# Altium schematic sheet 0174_IMVP VCCGT _SOC_.SchDoc
size 848 x 558 mm
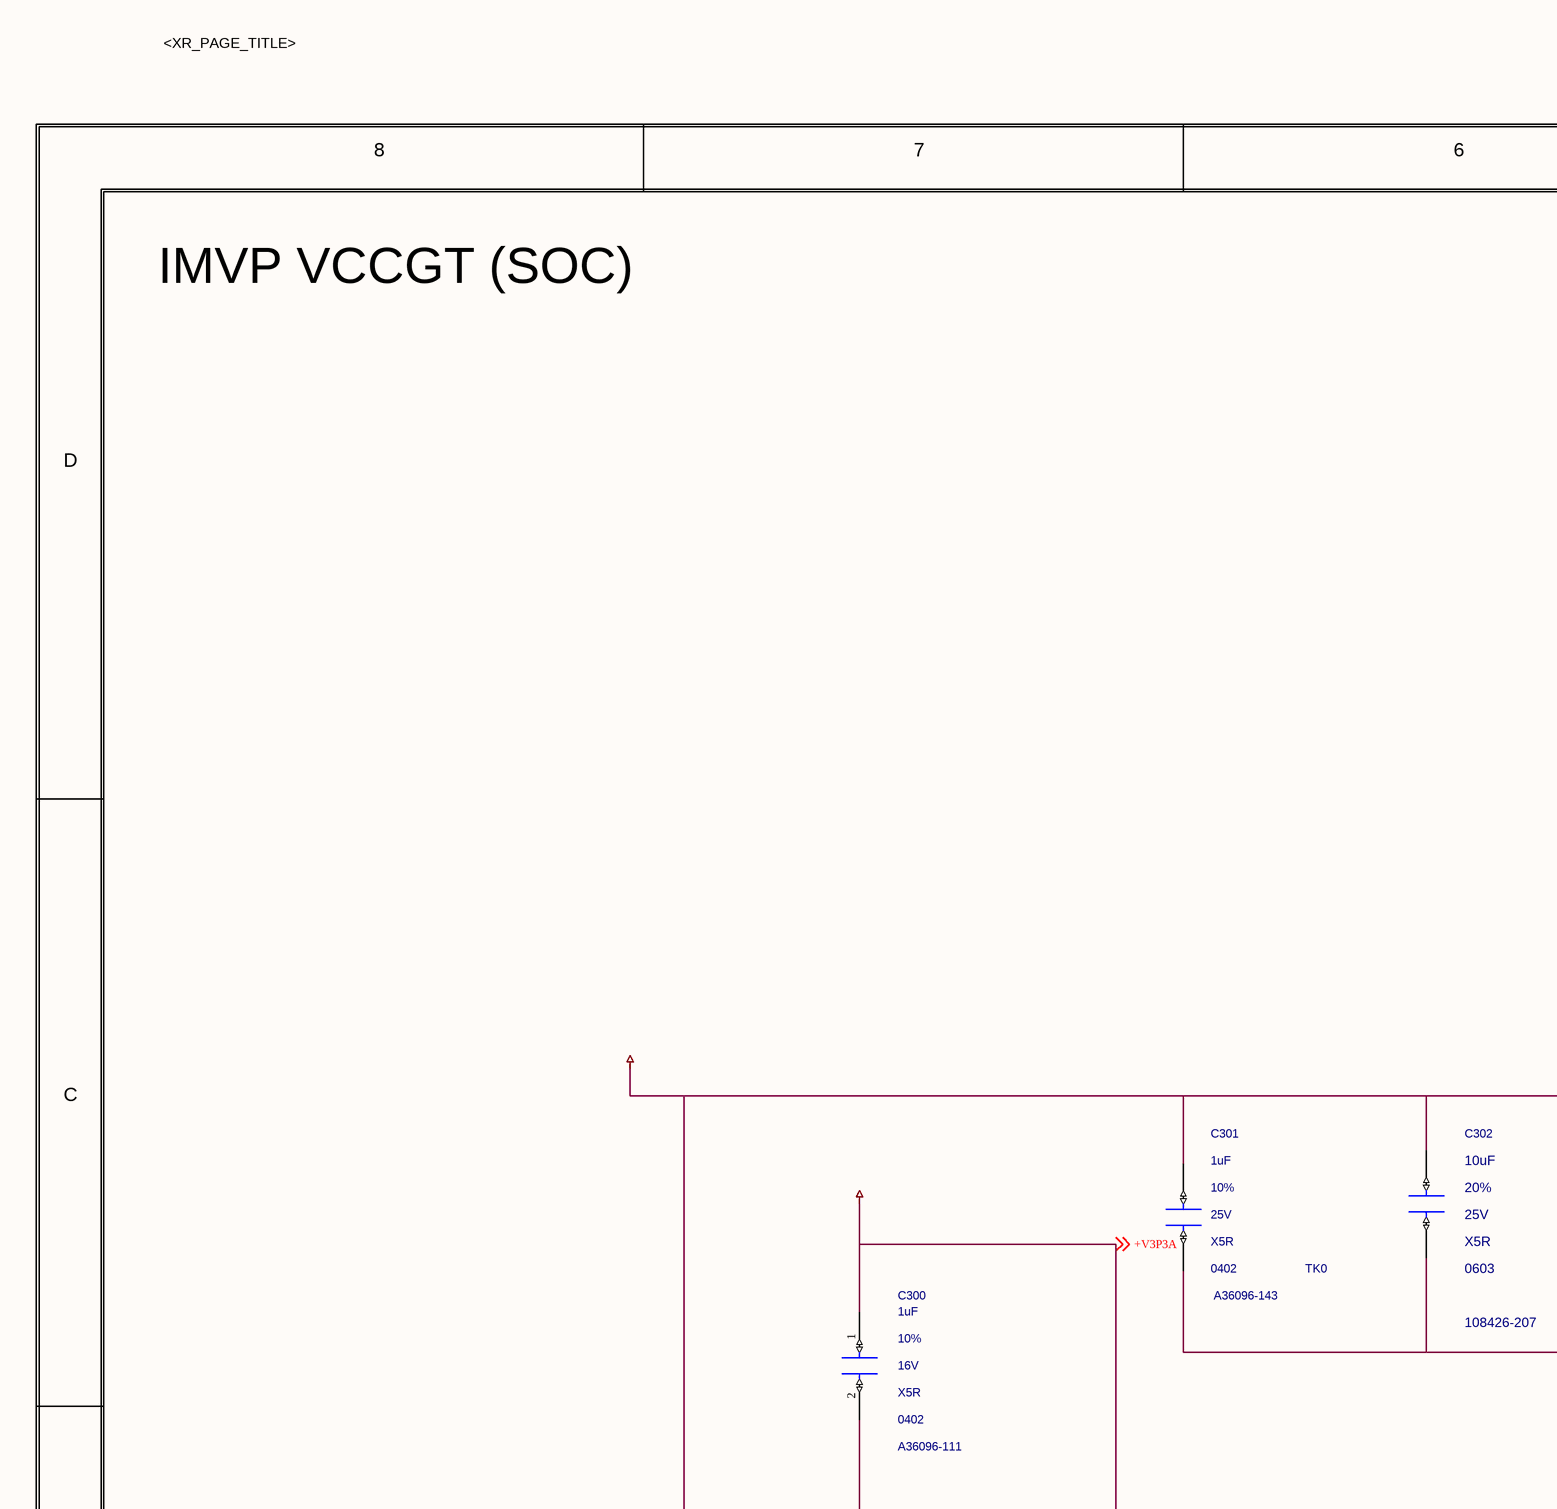
[diagram p0: 0174_IMVP VCCGT _SOC_.SchDoc, top left]
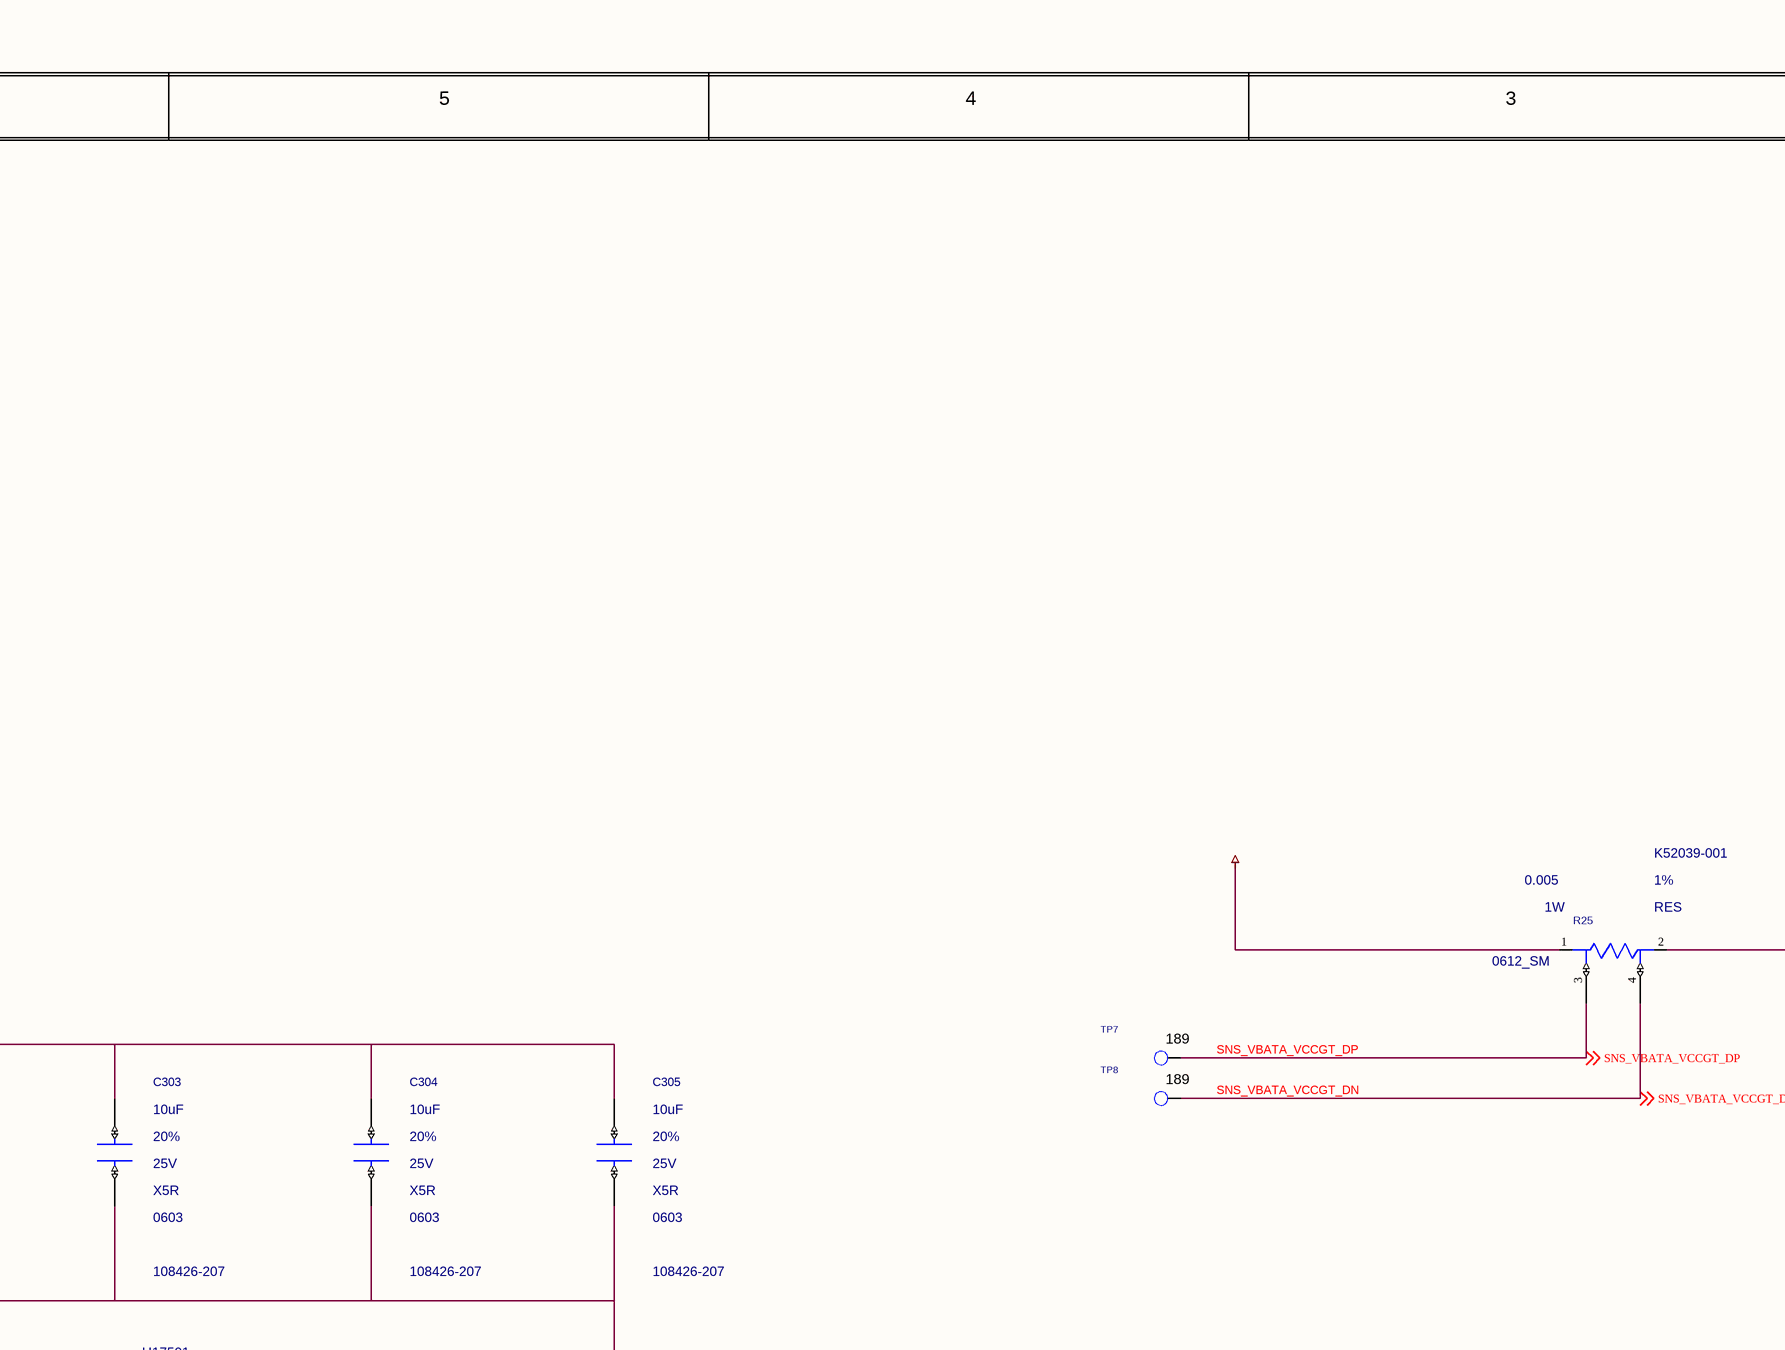
[diagram p1: 0174_IMVP VCCGT _SOC_.SchDoc, top middle]
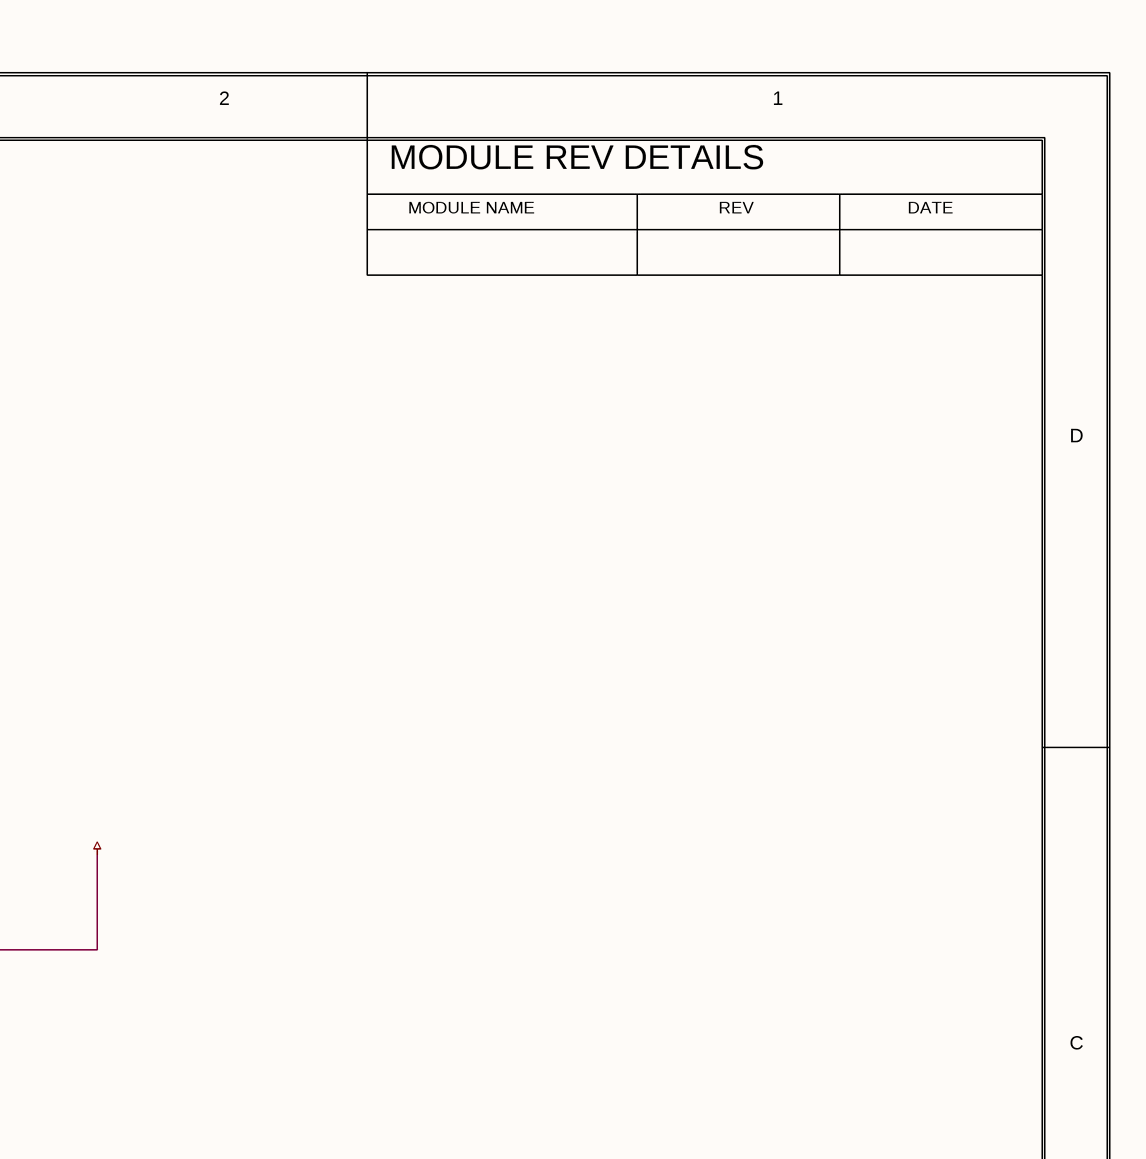
[diagram p2: 0174_IMVP VCCGT _SOC_.SchDoc, top right]
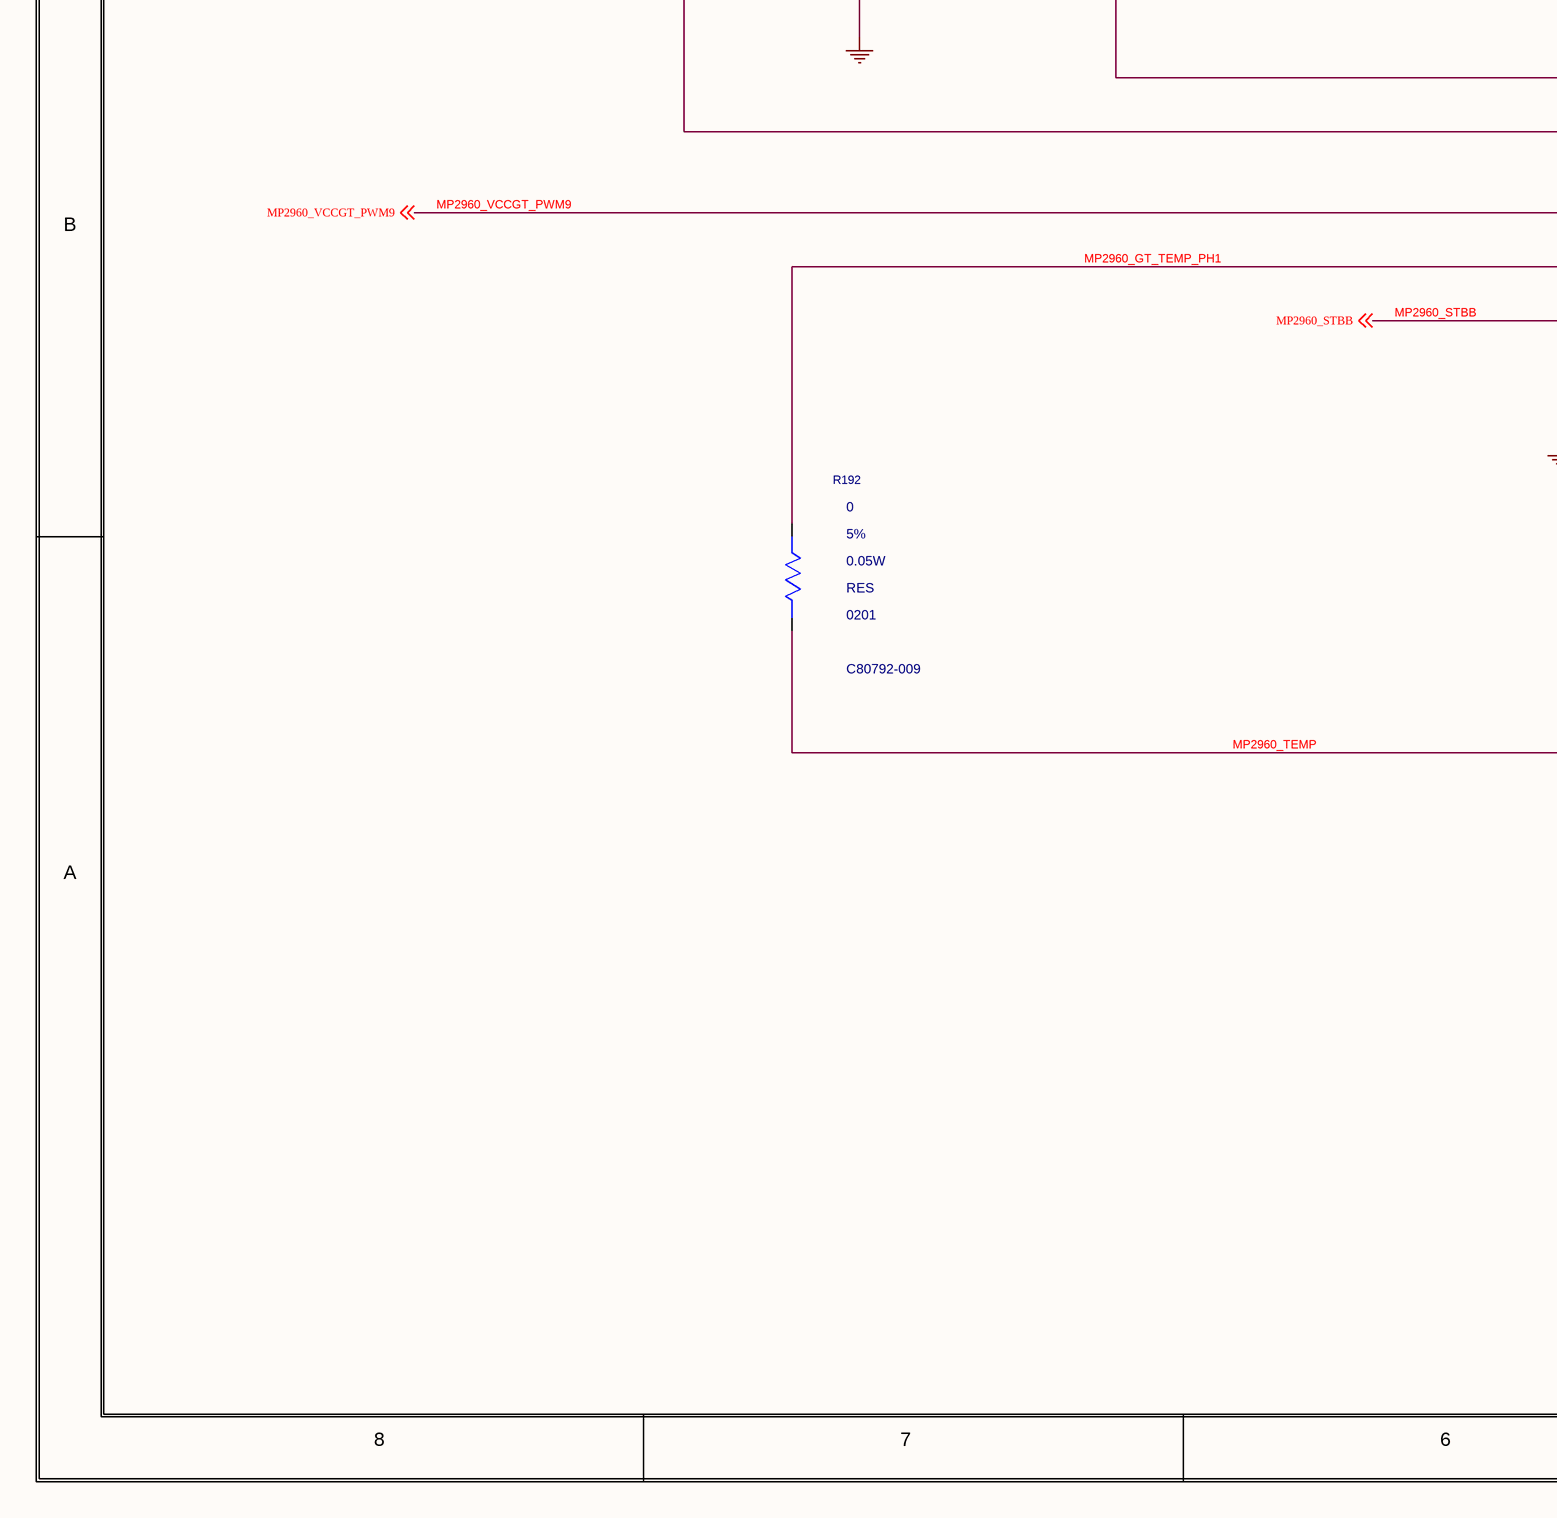
[diagram p3: 0174_IMVP VCCGT _SOC_.SchDoc, bottom left]
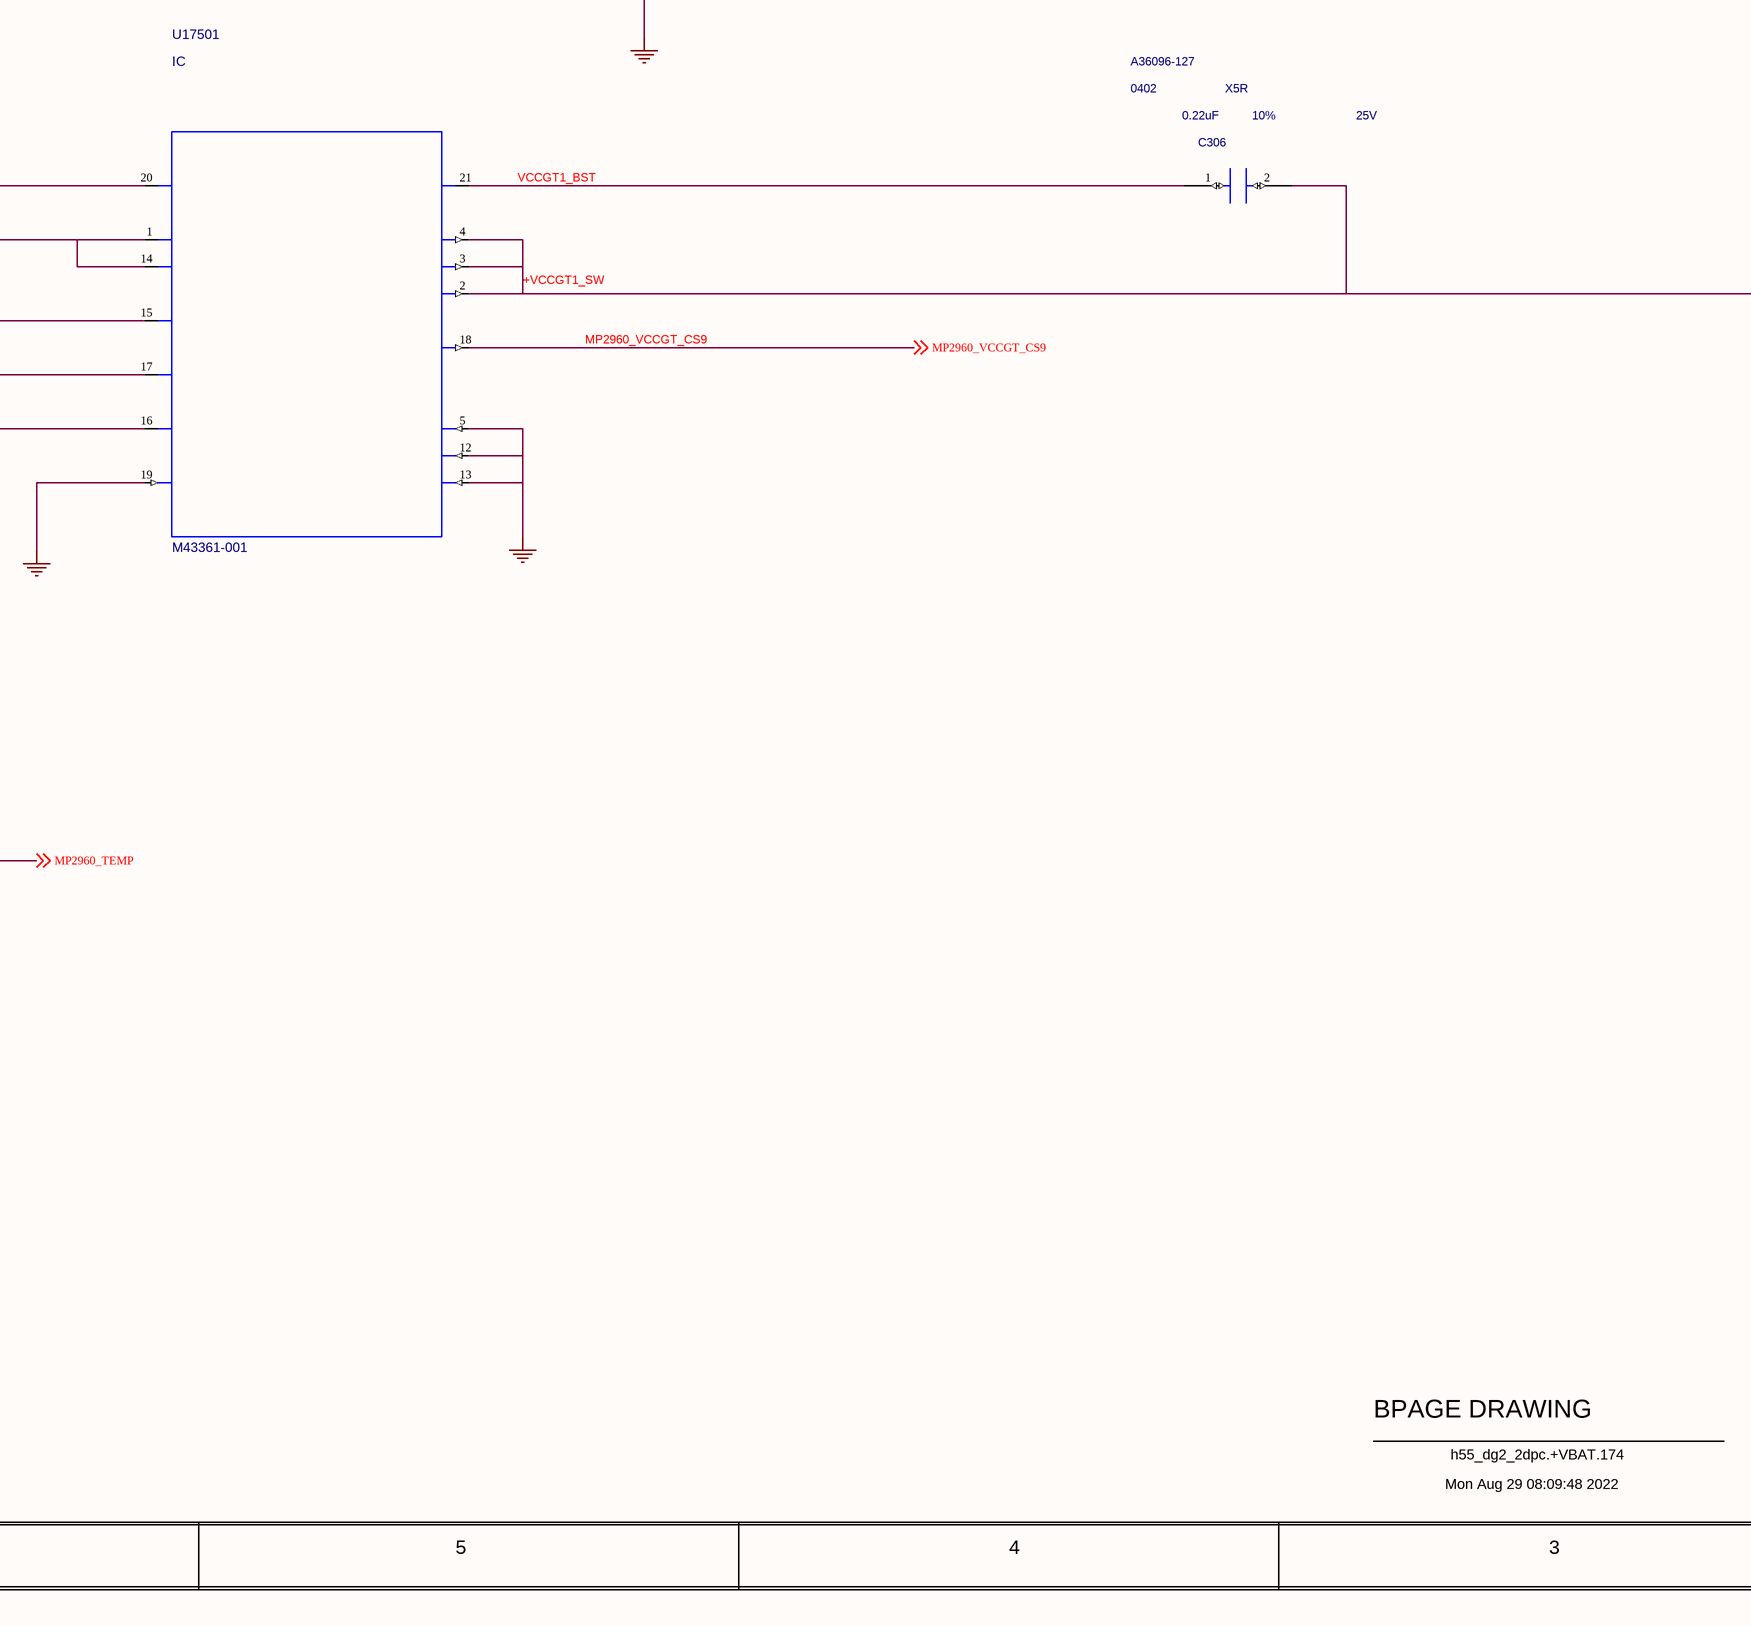
[diagram p4: 0174_IMVP VCCGT _SOC_.SchDoc, bottom middle]
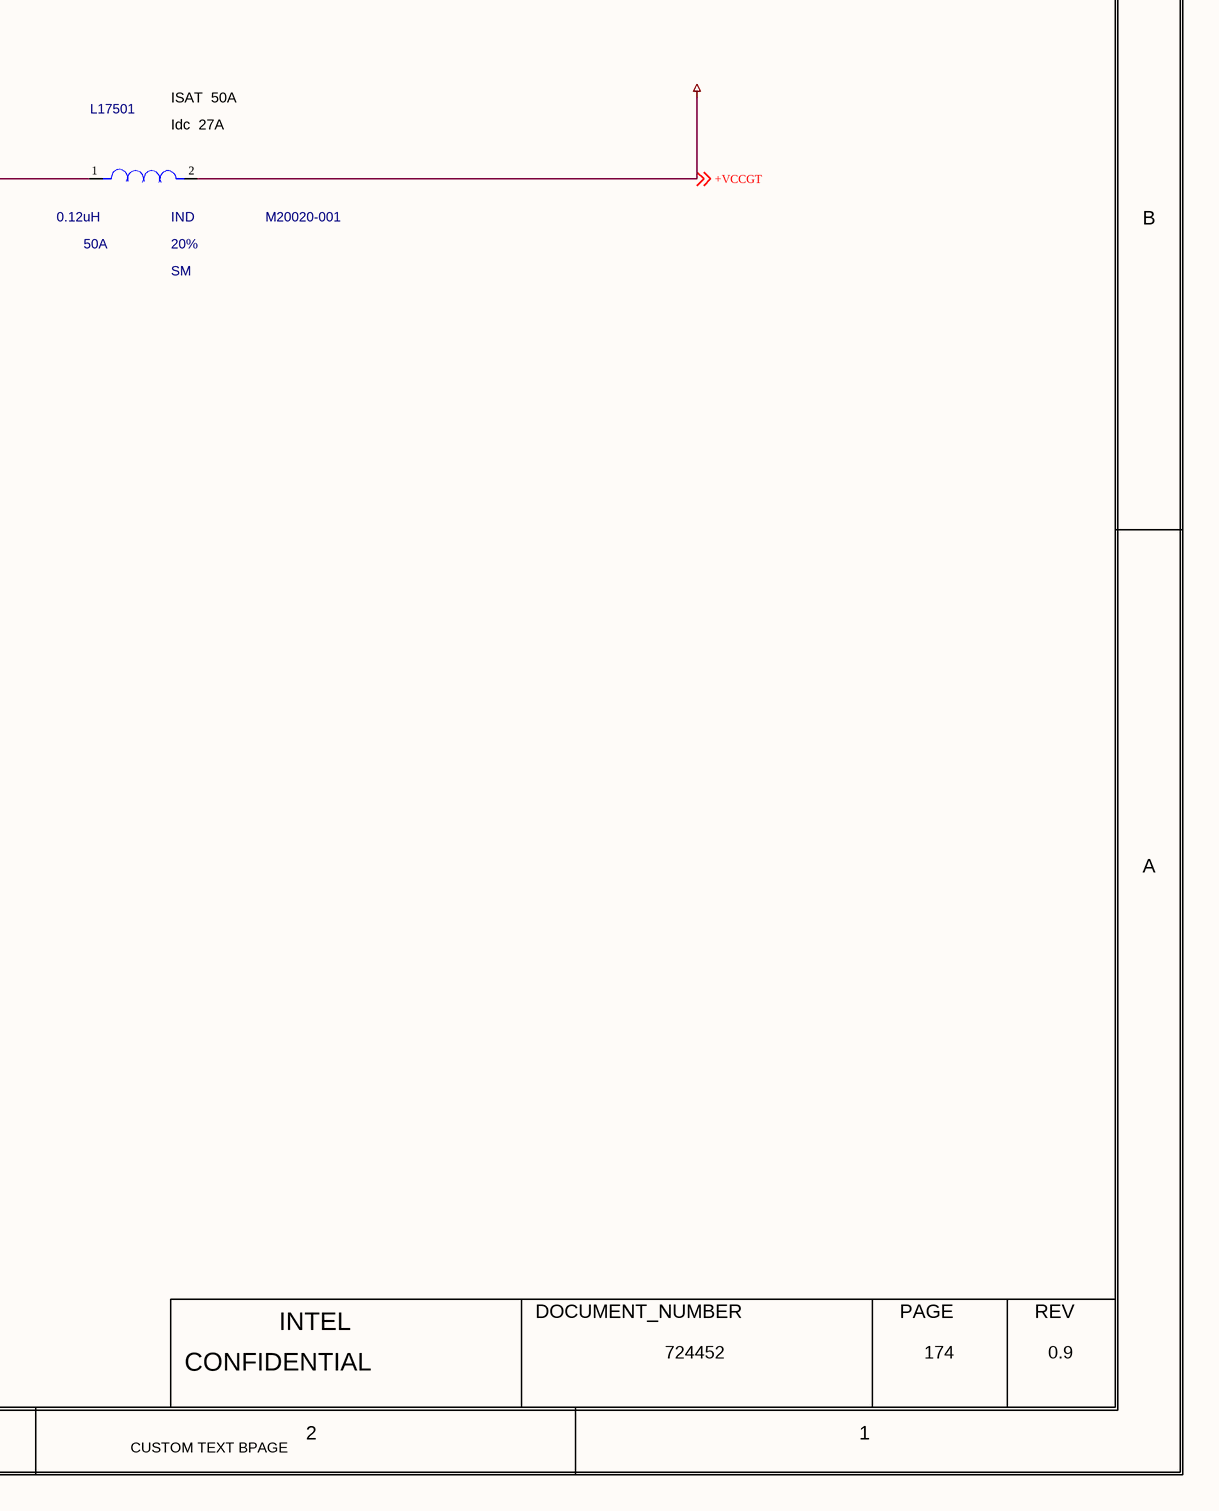
[diagram p5: 0174_IMVP VCCGT _SOC_.SchDoc, bottom right]

## Parts
C300  1uF  MATERIAL: X5R  PACK_TYPE: 0402  PART_NUMBER: A36096-111  TOLERANCE: 10%  VOLTAGE: 16V  [SMC0402IA]
C301  1uF  FP_TECH: TK0  MATERIAL: X5R  PACK_TYPE: 0402  PART_NUMBER: A36096-143  TOLERANCE: 10%  VOLTAGE: 25V  [CTK0_SM0402_1050X550_MA]
C302  10uF  MATERIAL: X5R  PACK_TYPE: 0603  PART_NUMBER: 108426-207  TOLERANCE: 20%  VOLTAGE: 25V  [CTK2_SM0603_1800X1000_MA]
C303  10uF  MATERIAL: X5R  PACK_TYPE: 0603  PART_NUMBER: 108426-207  TOLERANCE: 20%  VOLTAGE: 25V  [CTK2_SM0603_1800X1000_MA]
C304  10uF  MATERIAL: X5R  PACK_TYPE: 0603  PART_NUMBER: 108426-207  TOLERANCE: 20%  VOLTAGE: 25V  [CTK2_SM0603_1800X1000_MA]
C305  10uF  MATERIAL: X5R  PACK_TYPE: 0603  PART_NUMBER: 108426-207  TOLERANCE: 20%  VOLTAGE: 25V  [CTK2_SM0603_1800X1000_MA]
C306  0.22uF  MATERIAL: X5R  PACK_TYPE: 0402  PART_NUMBER: A36096-127  TOLERANCE: 10%  VOLTAGE: 25V  [SMC1005MB]
L17501  0.12uH  CURRENT: 50A  MATERIAL: IND  PACK_TYPE: SM  PART_NUMBER: M20020-001  TOLERANCE: 20%  [CTK2_SM_6000X5400_MB]
R25  0.005  MATERIAL: RES  PACK_TYPE: 0612_SM  PART_NUMBER: K52039-001  TOLERANCE: 1%  WATTAGE: 1W  [CTK0_SMR4_0612_1800X3450_MB_VR]
R192  0  MATERIAL: RES  PACK_TYPE: 0201  PART_NUMBER: C80792-009  TOLERANCE: 5%  WATTAGE: 0.05W  [CTK0_SM0201_630X330_MA]
TP7  TP  [TP_C25]  (value not drawn)
TP8  TP  [TP_C25]  (value not drawn)
U17501  MATERIAL: IC  PART_NUMBER: M43361-001  [CTK1_LCC21_3100X5100_400_DF3P_MA_VR]  (hidden comment: C_MP86941)

## Nets
+V3P3A: C300.1(A) U17501.20(VCC) ; off-sheet +V3P3A
+VBATA: R25.1(PWRA)
+VBATA_VCCGT: C301.1(A) C302.1(A) C303.1(A) C304.1(A) C305.1(A) R25.2(PWRB) U17501.1(VIN_1) U17501.14(VIN_2)
+VCCGT: L17501.2(INB) ; off-sheet +VCCGT
GND: C300.2(B) C301.2(B) C302.2(B) C303.2(B) C304.2(B) C305.2(B) U17501.5(PGND_1) U17501.12(PGND_2) U17501.13(PGND_3) U17501.19(AGND)
+VCCGT1_SW: C306.2(B) L17501.1(INA) U17501.2(SW_1) U17501.3(SW_2) U17501.4(SW_3)
MP2960_GT_TEMP_PH1: R192.1(A) U17501.17(VTEMP_FLT)
MP2960_STBB: U17501.16(SYNC) ; off-sheet MP2960_STBB
MP2960_TEMP: R192.2(B) ; off-sheet MP2960_TEMP
MP2960_VCCGT_CS9: U17501.18(CS) ; off-sheet MP2960_VCCGT_CS9
MP2960_VCCGT_PWM9: U17501.15(PWM) ; off-sheet MP2960_VCCGT_PWM9
SNS_VBATA_VCCGT_DN: R25.4(SENB) TP8.1(TP) ; off-sheet SNS_VBATA_VCCGT_DN
SNS_VBATA_VCCGT_DP: R25.3(SENA) TP7.1(TP) ; off-sheet SNS_VBATA_VCCGT_DP
VCCGT1_BST: C306.1(A) U17501.21(BST)

## Notes on the sheet
- <XR_PAGE_TITLE>
- 8
- 7
- 6
- 5
- 4
- 3
- 2
- 1
- MODULE REV DETAILS
- IMVP VCCGT (SOC)
- MODULE NAME
- REV
- DATE
- D
- C
- (near TP7) 189
- 189
- ISAT  50A
- (near L17501) Idc  27A
- B
- A
- BPAGE DRAWING
- INTEL
- DOCUMENT_NUMBER
- PAGE
- Mon Aug 29 08:09:48 2022
- h55_dg2_2dpc.+VBAT.174
- CONFIDENTIAL
- 724452
- 174
- 0.9
- CUSTOM TEXT BPAGE

## Library data of the parts
C300 = CAP: CDS_PHYS_PART_NAME: CAP_0402-A36096-111,X5R,1UF,16V,10%,LPDB,GENERIC; OriginalSymbolOrigin: (-50,25); XY: (-975,1850); VER: 1; ROT: 0; PHYS_PAGE: 174; LOCATION: C300; DRAWING: @RVP1_ADL_SB_ADP_S_DDR5_SODIMM_2DPC_LIB.H55_DG2_2DPC(SCH_1):PAGE543; CDS_LIB: discrete; PCB Footprint: SMC0402IA; CHIPS_PART_NAME: CAP; CDS_PART_NAME: CAP_0402-A36096-111,X5R,1UF,16V,10%,LPDB,GENERIC; CDS_LOCATION: C300
C301 = C_CAP: CDS_PHYS_PART_NAME: C_CAP_0402-A36096-143,X5R,1UF,25V,10%,TK0,GENERIC; CDS_LMAN_SYM_OUTLINE: -50,50,50,-50; IP: GENERIC; ROOM: NONE; OriginalSymbolOrigin: (-50,25); XY: (-375,2125); VER: 1; ROT: 0; PHYS_PAGE: 174; LOCATION: C301; DRAWING: @RVP1_ADL_SB_ADP_S_DDR5_SODIMM_2DPC_LIB.H55_DG2_2DPC(SCH_1):PAGE543; CDS_LIB: c_discrete; VARIANT: ?; PCB Footprint: CTK0_SM0402_1050X550_MA; CHIPS_PART_NAME: C_CAP; CDS_PART_NAME: C_CAP_0402-A36096-143,X5R,1UF,25V,10%,TK0,GENERIC; CDS_LOCATION: C301
C302 = C_CAP: CDS_PHYS_PART_NAME: C_CAP_0603-108426-207,X5R,10UF,25V,20%,TK2,GENERIC; CDS_LMAN_SYM_OUTLINE: -50,50,50,-50; FP_TECH: TK2; IP: GENERIC; ROOM: NONE; OriginalSymbolOrigin: (-50,25); XY: (75,2150); VER: 1; ROT: 0; PHYS_PAGE: 174; LOCATION: C302; DRAWING: @RVP1_ADL_SB_ADP_S_DDR5_SODIMM_2DPC_LIB.H55_DG2_2DPC(SCH_1):PAGE543; CDS_LIB: c_discrete; VARIANT: ?; PCB Footprint: CTK2_SM0603_1800X1000_MA; CHIPS_PART_NAME: C_CAP; CDS_PART_NAME: C_CAP_0603-108426-207,X5R,10UF,25V,20%,TK2,GENERIC; CDS_LOCATION: C302
C303 = C_CAP: CDS_PHYS_PART_NAME: C_CAP_0603-108426-207,X5R,10UF,25V,20%,TK2,GENERIC; CDS_LMAN_SYM_OUTLINE: -50,50,50,-50; FP_TECH: TK2; IP: GENERIC; ROOM: NONE; OriginalSymbolOrigin: (-50,25); XY: (525,2150); VER: 1; ROT: 0; PHYS_PAGE: 174; LOCATION: C303; DRAWING: @RVP1_ADL_SB_ADP_S_DDR5_SODIMM_2DPC_LIB.H55_DG2_2DPC(SCH_1):PAGE543; CDS_LIB: c_discrete; VARIANT: ?; PCB Footprint: CTK2_SM0603_1800X1000_MA; CHIPS_PART_NAME: C_CAP; CDS_PART_NAME: C_CAP_0603-108426-207,X5R,10UF,25V,20%,TK2,GENERIC; CDS_LOCATION: C303
C304 = C_CAP: CDS_PHYS_PART_NAME: C_CAP_0603-108426-207,X5R,10UF,25V,20%,TK2,GENERIC; CDS_LMAN_SYM_OUTLINE: -50,50,50,-50; FP_TECH: TK2; IP: GENERIC; ROOM: NONE; OriginalSymbolOrigin: (-50,25); XY: (1000,2150); VER: 1; ROT: 0; PHYS_PAGE: 174; LOCATION: C304; DRAWING: @RVP1_ADL_SB_ADP_S_DDR5_SODIMM_2DPC_LIB.H55_DG2_2DPC(SCH_1):PAGE543; CDS_LIB: c_discrete; VARIANT: ?; PCB Footprint: CTK2_SM0603_1800X1000_MA; CHIPS_PART_NAME: C_CAP; CDS_PART_NAME: C_CAP_0603-108426-207,X5R,10UF,25V,20%,TK2,GENERIC; CDS_LOCATION: C304
C305 = C_CAP: CDS_PHYS_PART_NAME: C_CAP_0603-108426-207,X5R,10UF,25V,20%,TK2,GENERIC; CDS_LMAN_SYM_OUTLINE: -50,50,50,-50; FP_TECH: TK2; IP: GENERIC; ROOM: NONE; OriginalSymbolOrigin: (-50,25); XY: (1450,2150); VER: 1; ROT: 0; PHYS_PAGE: 174; LOCATION: C305; DRAWING: @RVP1_ADL_SB_ADP_S_DDR5_SODIMM_2DPC_LIB.H55_DG2_2DPC(SCH_1):PAGE543; CDS_LIB: c_discrete; VARIANT: ?; PCB Footprint: CTK2_SM0603_1800X1000_MA; CHIPS_PART_NAME: C_CAP; CDS_PART_NAME: C_CAP_0603-108426-207,X5R,10UF,25V,20%,TK2,GENERIC; CDS_LOCATION: C305
C306 = CAP#1: CHIPS_PART_NAME: CAP; CDS_PHYS_PART_NAME: CAP_0402-A36096-127,X5R,0.22UF,25V,10%,LPDB,GENERIC; OriginalSymbolOrigin: (-25,50); XY: (2550,1500); VER: 2; ROT: 0; PHYS_PAGE: 174; LOCATION: C306; DRAWING: @RVP1_ADL_SB_ADP_S_DDR5_SODIMM_2DPC_LIB.H55_DG2_2DPC(SCH_1):PAGE543; CDS_LIB: discrete; PCB Footprint: SMC1005MB; CDS_PART_NAME: CAP_0402-A36096-127,X5R,0.22UF,25V,10%,LPDB,GENERIC; CDS_LOCATION: C306
L17501 = C_INDUCTOR: CDS_PHYS_PART_NAME: C_INDUCTOR_SM-M20020-001,IND,0.12UH,20%,50A,TK2,GENERIC; CDS_LMAN_SYM_OUTLINE: -100,50,100,-50; FP_TECH: TK2; IP: GENERIC; ROOM: NONE; OriginalSymbolOrigin: (-75,25); XY: (3825,1300); VER: 1; ROT: 0; PHYS_PAGE: 174; LOCATION: L17501; DRAWING: @RVP1_ADL_SB_ADP_S_DDR5_SODIMM_2DPC_LIB.H55_DG2_2DPC(SCH_1):PAGE543; CDS_LIB: local; VARIANT: ?; PCB Footprint: CTK2_SM_6000X5400_MB; CHIPS_PART_NAME: C_INDUCTOR; CDS_PART_NAME: C_INDUCTOR_SM-M20020-001,IND,0.12UH,20%,50A,TK2,GENERIC; CDS_LOCATION: L17501
R25 = C_RES_4TERM: CDS_PHYS_PART_NAME: C_RES_4TERM_0612_SM-K52039-001,RES,0.005,1%,1W,TK0,GENERIC; CDS_LMAN_SYM_OUTLINE: -50,50,50,-50; FP_TECH: TK0; IP: GENERIC; ROOM: NONE; OriginalSymbolOrigin: (-75,25); XY: (3300,2525); VER: 1; SUB_ROOM_2: PMR; SUB_ROOM_1: V_CHRG_LDO; ROT: 0; PHYS_PAGE: 174; LOCATION: R25; DRAWING: @RVP1_ADL_SB_ADP_S_DDR5_SODIMM_2DPC_LIB.H55_DG2_2DPC(SCH_1):PAGE543; CDS_LIB: c_discrete; VARIANT: ?; PCB Footprint: CTK0_SMR4_0612_1800X3450_MB_VR; SUB_ROOM: PMR; CHIPS_PART_NAME: C_RES_4TERM; CDS_PART_NAME: C_RES_4TERM_0612_SM-K52039-001,RES,0.005,1%,1W,TK0,GENERIC; CDS_LOCATION: R25
R192 = C_RES: CDS_PHYS_PART_NAME: C_RES_0201-C80792-009,RES,0,5%,0.05W,TK0,GENERIC; CDS_LMAN_SYM_OUTLINE: -50,50,50,-50; FP_TECH: TK0; IP: GENERIC; ROOM: NONE; OriginalSymbolOrigin: (-25,75); XY: (-1100,575); VER: 2; SUB_ROOM: VCCSA; PHYS_PAGE: 174; LOCATION: R192; DRAWING: @RVP1_ADL_SB_ADP_S_DDR5_SODIMM_2DPC_LIB.H55_DG2_2DPC(SCH_1):PAGE543; CDS_LIB: c_discrete; VARIANT: ?; PCB Footprint: CTK0_SM0201_630X330_MA; ROT: 0; CHIPS_PART_NAME: C_RES; CDS_PART_NAME: C_RES_0201-C80792-009,RES,0,5%,0.05W,TK0,GENERIC; CDS_LOCATION: R192
TP7 = TP#3: PART_NUMBER: NA_TPC25; CDS_PHYS_PART_NAME: TP_SM-NA_TPC25,EMPTY,TP_C25,LPDB,GENERIC; CDS_LMAN_SYM_OUTLINE: -100,50,100,-50; PACK_TYPE: SM; OriginalSymbolOrigin: (0,25); XY: (2450,2325); VER: 6; ROT: 0; ROOM: ROOM_PROP_TEST_70; PHYS_PAGE: 174; LOCATION: TP7; DRAWING: @RVP1_ADL_SB_ADP_S_DDR5_SODIMM_2DPC_LIB.H55_DG2_2DPC(SCH_1):PAGE543; CDS_LIB: board_artifacts; MATERIAL: EMPTY; PCB Footprint: TP_C25; CHIPS_PART_NAME: TP; CDS_PART_NAME: TP_SM-NA_TPC25,EMPTY,TP_C25,LPDB,GENERIC; CDS_LOCATION: TP7
TP8 = TP#3: PART_NUMBER: NA_TPC25; CDS_PHYS_PART_NAME: TP_SM-NA_TPC25,EMPTY,TP_C25,LPDB,GENERIC; CDS_LMAN_SYM_OUTLINE: -100,50,100,-50; PACK_TYPE: SM; OriginalSymbolOrigin: (0,25); XY: (2450,2250); VER: 6; ROT: 0; ROOM: ROOM_PROP_TEST_70; PHYS_PAGE: 174; LOCATION: TP8; DRAWING: @RVP1_ADL_SB_ADP_S_DDR5_SODIMM_2DPC_LIB.H55_DG2_2DPC(SCH_1):PAGE543; CDS_LIB: board_artifacts; MATERIAL: EMPTY; PCB Footprint: TP_C25; CHIPS_PART_NAME: TP; CDS_PART_NAME: TP_SM-NA_TPC25,EMPTY,TP_C25,LPDB,GENERIC; CDS_LOCATION: TP8
U17501 = C_MP86941: CDS_PHYS_PART_NAME: C_MP86941_LCC-M43361-001,IC,MP86941-CGQVT,TK1,GENERIC; CDS_LMAN_SYM_OUTLINE: -250,400,250,-350; FP_TECH: TK1; IP: GENERIC; PACK_TYPE: LCC; ROOM: NONE; OriginalSymbolOrigin: (-275,400); XY: (825,1200); VER: 1; ROT: 0; PHYS_PAGE: 174; LOCATION: U17501; DRAWING: @RVP1_ADL_SB_ADP_S_DDR5_SODIMM_2DPC_LIB.H55_DG2_2DPC(SCH_1):PAGE543; CDS_LIB: local; VARIANT: ?; PCB Footprint: CTK1_LCC21_3100X5100_400_DF3P_MA_VR; SEC_TYPE: LCC; CHIPS_PART_NAME: C_MP86941; CDS_PART_NAME: C_MP86941_LCC-M43361-001,IC,MP86941-CGQVT,TK1,GENERIC; CDS_LOCATION: U17501